# Altium schematic sheet Connectors.SchDoc
size A
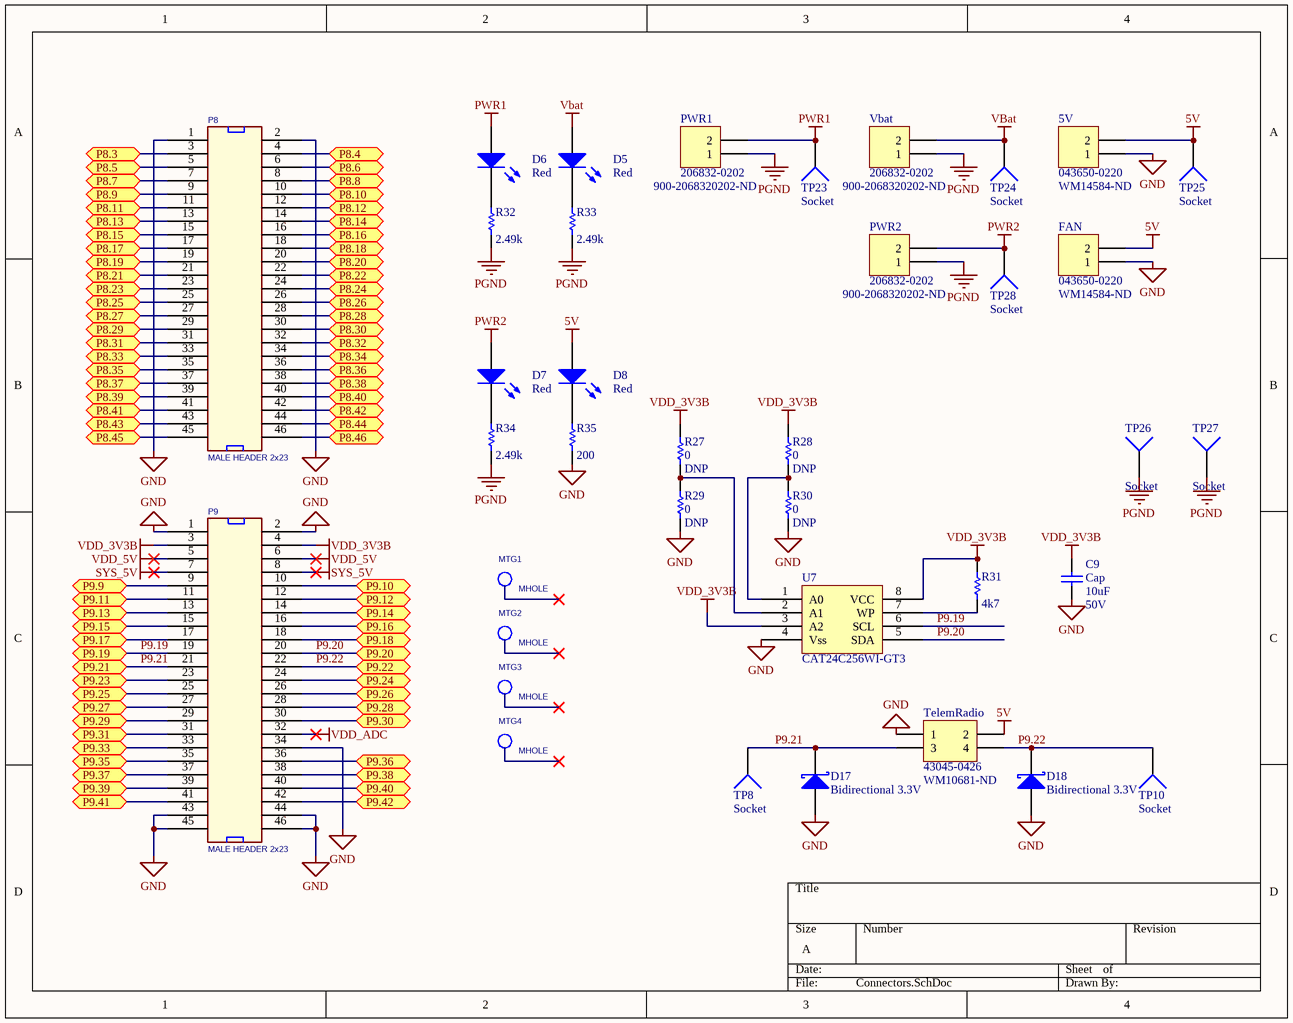
[diagram p0: Connectors.SchDoc]

## Parts
5V  043650-0220  Vendor Part Number: WM14584-ND  [43650-0220]
C9  Cap  value 10uF  Voltage Rating: 50V  [CAPC3216X180N]
D5  Color: Red  [THRMC0603X33N]  (hidden comment: LED0)
D6  Color: Red  [THRMC0603X33N]  (hidden comment: LED0)
D7  Color: Red  [THRMC0603X33N]  (hidden comment: LED0)
D8  Color: Red  [THRMC0603X33N]  (hidden comment: LED0)
D17  Bidirectional 3.3V  [THRMC0603X33N]
D18  Bidirectional 3.3V  [THRMC0603X33N]
FAN  043650-0220  Vendor Part Number: WM14584-ND  [43650-0220]
MTG1  MHOLE  [MTGH200C125D_PL]  (no BOM)
MTG2  MHOLE  [MTGH200C125D_PL]  (no BOM)
MTG3  MHOLE  [MTGH200C125D_PL]  (no BOM)
MTG4  MHOLE  [MTGH200C125D_PL]  (no BOM)
P8  MALE HEADER 2x23  [95278-101B46LF]
P9  MALE HEADER 2x23  [95278-101B46LF]
PWR1  206832-0202  Vendor Part Number: 900-2068320202-ND  [206832-0202]
PWR2  206832-0202  Vendor Part Number: 900-2068320202-ND  [206832-0202]
R27  value 0  [0402]  (hidden comment: Res1)
R28  value 0  [0402]  (hidden comment: Res1)
R29  value 0  [0402]  (hidden comment: Res1)
R30  value 0  [0402]  (hidden comment: Res1)
R31  value 4k7  [0402]  (hidden comment: Res1)
R32  value 2.49k  [0402]  (hidden comment: Res1)
R33  value 2.49k  [0402]  (hidden comment: Res1)
R34  value 2.49k  [0402]  (hidden comment: Res1)
R35  value 200  [0402]  (hidden comment: Res1)
TelemRadio  43045-0426  Vendor Part Number: WM10681-ND  [43045-0426]
TP8  Socket  [5006]
TP10  Socket  [5006]
TP23  Socket  [5006]
TP24  Socket  [5006]
TP25  Socket  [5006]
TP26  Socket  [5006]
TP27  Socket  [5006]
TP28  Socket  [5006]
U7  CAT24C256WI-GT3  [SOIC127P599X175-8N]
Vbat  206832-0202  Vendor Part Number: 900-2068320202-ND  [206832-0202]

## Ports
P8.3, P8.4, P8.5, P8.6, P8.7, P8.8, P8.9, P8.10, P8.11, P8.12, P8.13, P8.14, P8.15, P8.16, P8.17, P8.18, P8.19, P8.20, P8.21, P8.22, P8.23, P8.24, P8.25, P8.26, P8.27, P8.28, P8.29, P8.30, P8.31, P8.32, P8.33, P8.34, P8.35, P8.36, P8.37, P8.38, P8.39, P8.40, P8.41, P8.42, P8.43, P8.44, P8.45, P8.46, P9.9, P9.10, P9.11, P9.12, P9.13, P9.14, P9.15, P9.16, P9.17, P9.18, P9.19, P9.20, P9.21, P9.22, P9.23, P9.24, P9.25, P9.26, P9.27, P9.28, P9.29, P9.30, P9.31, P9.33, P9.35, P9.36, P9.37, P9.38, P9.39, P9.40, P9.41, P9.42

## Nets
5V: 5V.2 D8.1(A) FAN.2 TelemRadio.2 TP25.1
GND: 5V.1 C9.1 D17.3(A) D18.3(A) FAN.1 P8.1 P8.2 P9.1 P9.2 P9.34 P9.43 P9.44 P9.45 P9.46 R29.1 R30.1 R35.2 TelemRadio.1 U7.4(Vss)
PGND: PWR1.1 PWR2.1 R32.2 R33.2 R34.2 TP26.1 TP27.1 Vbat.1
PWR1: D6.1(A) PWR1.2 TP23.1
PWR2: D7.1(A) PWR2.2 TP28.1
SYS_5V: P9.7 P9.8
VBat: D5.1(A) TP24.1 Vbat.2
VDD_3V3B: C9.2 P9.3 P9.4 R27.2 R28.2 R31.1 U7.3(A2) U7.8(VCC)
VDD_5V: P9.5 P9.6
VDD_ADC: P9.32
P8.3: P8.3 ; port P8.3
P8.4: P8.4 ; port P8.4
P8.5: P8.5 ; port P8.5
P8.6: P8.6 ; port P8.6
P8.7: P8.7 ; port P8.7
P8.8: P8.8 ; port P8.8
P8.9: P8.9 ; port P8.9
P8.10: P8.10 ; port P8.10
P8.11: P8.11 ; port P8.11
P8.12: P8.12 ; port P8.12
P8.13: P8.13 ; port P8.13
P8.14: P8.14 ; port P8.14
P8.15: P8.15 ; port P8.15
P8.16: P8.16 ; port P8.16
P8.17: P8.17 ; port P8.17
P8.18: P8.18 ; port P8.18
P8.19: P8.19 ; port P8.19
P8.20: P8.20 ; port P8.20
P8.21: P8.21 ; port P8.21
P8.22: P8.22 ; port P8.22
P8.23: P8.23 ; port P8.23
P8.24: P8.24 ; port P8.24
P8.25: P8.25 ; port P8.25
P8.26: P8.26 ; port P8.26
P8.27: P8.27 ; port P8.27
P8.28: P8.28 ; port P8.28
P8.29: P8.29 ; port P8.29
P8.30: P8.30 ; port P8.30
P8.31: P8.31 ; port P8.31
P8.32: P8.32 ; port P8.32
P8.33: P8.33 ; port P8.33
P8.34: P8.34 ; port P8.34
P8.35: P8.35 ; port P8.35
P8.36: P8.36 ; port P8.36
P8.37: P8.37 ; port P8.37
P8.38: P8.38 ; port P8.38
P8.39: P8.39 ; port P8.39
P8.40: P8.40 ; port P8.40
P8.41: P8.41 ; port P8.41
P8.42: P8.42 ; port P8.42
P8.43: P8.43 ; port P8.43
P8.44: P8.44 ; port P8.44
P8.45: P8.45 ; port P8.45
P8.46: P8.46 ; port P8.46
P9.9: P9.9 ; port P9.9
P9.10: P9.10 ; port P9.10
P9.11: P9.11 ; port P9.11
P9.12: P9.12 ; port P9.12
P9.13: P9.13 ; port P9.13
P9.14: P9.14 ; port P9.14
P9.15: P9.15 ; port P9.15
P9.16: P9.16 ; port P9.16
P9.17: P9.17 ; port P9.17
P9.18: P9.18 ; port P9.18
P9.19: P9.19 U7.6(SCL) ; port P9.19
P9.20: P9.20 U7.5(SDA) ; port P9.20
P9.21: D17.1(K) P9.21 TelemRadio.3 TP8.1 ; port P9.21
P9.22: D18.1(K) P9.22 TelemRadio.4 TP10.1 ; port P9.22
P9.23: P9.23 ; port P9.23
P9.24: P9.24 ; port P9.24
P9.25: P9.25 ; port P9.25
P9.26: P9.26 ; port P9.26
P9.27: P9.27 ; port P9.27
P9.28: P9.28 ; port P9.28
P9.29: P9.29 ; port P9.29
P9.30: P9.30 ; port P9.30
P9.31: P9.31 ; port P9.31
P9.33: P9.33 ; port P9.33
P9.35: P9.35 ; port P9.35
P9.36: P9.36 ; port P9.36
P9.37: P9.37 ; port P9.37
P9.38: P9.38 ; port P9.38
P9.39: P9.39 ; port P9.39
P9.40: P9.40 ; port P9.40
P9.41: P9.41 ; port P9.41
P9.42: P9.42 ; port P9.42
NetD5_3: D5.3(K) R33.1
NetD6_3: D6.3(K) R32.1
NetD7_3: D7.3(K) R34.1
NetD8_3: D8.3(K) R35.1
NetR27_1: R27.1 R29.2 U7.2(A1)
NetR28_1: R28.1 R30.2 U7.1(A0)
NetR31_2: R31.2 U7.7(WP)

Not connected (* = marked no-connect by the designer): MTG1 1(TP)*; MTG2 1(TP)*; MTG3 1(TP)*; MTG4 1(TP)*

## Library data of the parts
5V FAN PWR1 PWR2 Vbat = Header 2: Header, 2-Pin; LatestRevisionDate: 17-Jul-2002; LatestRevisionNote: Re-released for DXP Platform.; Publisher: Altium Limited
  PWR1 PWR2 Vbat: Manufacturer Part Number: 206832-0202
C9 = Cap: Capacitor; Manufacturer Part Number: CL31A106MBHNNNE; Vendor Part Number: 1276-6736-1-ND
D5-D8 = LED0: Typical INFRARED GaAs LED; Vendor Part Number: 732-11991-1-ND; Manufacturer Part Number: 150040RS73240; Vf: 2V; I: 20mA
D17 D18 = Diode 10TQ040: TVS; Manufacturer Part Number: SP1103C-01UTG; Vendor Part Number: F10154CT-ND
P8 = HDR_46_F_2_0.1_0.1: CONN HEADER FMAL 46PS.1" DL GOLD; Manufacturer: Sullins Connector Solutions; Manufacturer Part Number: S7126-ND; Vendor Part Number: 95278-101-46LF; Vendor Part Number: 95278-101B46LF-ND; Number of Positions: 46; Number of Positions Loaded: All; Pitch: 0.100" (2.54mm); Supplier 1: Digi-Key; Supplier Part Number 1: S7126-ND; RoHS: RoHS Compliant; Category: Connectors, Interconnects; Stock 1: 750; Pricing 1: 1=2.75, 10=2.325, 25=2.2196, 50=2.0084, 100=1.7969, 250=1.58552, 500=1.4798, 1000=1.3741, 2500=1.32125 (USD); Connector Type: Header; Contact Type: Female Socket; Number of Rows: 2; Row Spacing: 0.100" (2.54mm); Mounting Type: Through Hole; Termination: Solder; Fastening Type: -; Features: -; Contact Finish: Gold; Contact Finish Thickness: Flash; Color: Black; Packaging: Bulk; ComponentLink1URL: http://www.sullinscorp.com/drawings/78_P(N)PxCxxxLFBN-RC,_10492-G.pdf; ComponentLink1Description: http://www.sullinscorp.com/drawings/78_P(N)PxCxxxLFBN-RC,_10492-G.pdf
P9 = HDR_46_F_2_0.1_0.1: CONN HEADER FMAL 46PS.1" DL GOLD; Manufacturer: Sullins Connector Solutions; Vendor Part Number: 95278-101-46LF; Vendor Part Number: 95278-101B46LF-ND; Number of Positions: 46; Number of Positions Loaded: All; Pitch: 0.100" (2.54mm); Supplier 1: Digi-Key; Supplier Part Number 1: S7126-ND; RoHS: RoHS Compliant; Category: Connectors, Interconnects; Stock 1: 750; Pricing 1: 1=2.75, 10=2.325, 25=2.2196, 50=2.0084, 100=1.7969, 250=1.58552, 500=1.4798, 1000=1.3741, 2500=1.32125 (USD); Connector Type: Header; Contact Type: Female Socket; Number of Rows: 2; Row Spacing: 0.100" (2.54mm); Mounting Type: Through Hole; Termination: Solder; Fastening Type: -; Features: -; Contact Finish: Gold; Contact Finish Thickness: Flash; Color: Black; Packaging: Bulk; ComponentLink1URL: http://www.sullinscorp.com/drawings/78_P(N)PxCxxxLFBN-RC,_10492-G.pdf; ComponentLink1Description: http://www.sullinscorp.com/drawings/78_P(N)PxCxxxLFBN-RC,_10492-G.pdf
R27-R30 = Res1: Resistor; Manufacturer Part Number: RC0402FR-070RL; Vendor Part Number: 311-0.0LRCT-ND; Tolerance: 1%; DNP: DNP
R31 = Res1: Resistor; Manufacturer Part Number: RC0402FR-074K7L; Vendor Part Number: 311-4.7KLRCT-ND; Tolerance: 1%
R32-R34 = Res1: Resistor; Manufacturer Part Number: RC0402FR-072K49L; Vendor Part Number: 311-2.49KLRCT-ND; Tolerance: 1%
R35 = Res1: Resistor; Manufacturer Part Number: RC0402FR-07200RL; Vendor Part Number: 311-200LRCT-ND; Tolerance: 1%
TelemRadio = Header 2X2: Header, 2-Pin, Dual row; LatestRevisionDate: 17-Jul-2002; LatestRevisionNote: Re-released for DXP Platform.; Publisher: Altium Limited
TP8 TP10 TP23-TP28 = Socket: Vendor Part Number: 36-5006-ND; LatestRevisionDate: 17-Jul-2002; LatestRevisionNote: Re-released for DXP Platform.; Publisher: Altium Limited; Manufacturer Part Number: 5006
U7 = CAT24C256WI-GT3: Vendor Part Number: CAT24C256WI-GT3OSCT-ND; Vendor: Digikey; Manufacturer Part Number: CAT24C256WI-GT3